# Altium schematic sheet LM_And_Busler_CAM.SchDoc
size A; SheetNumber: 5; SheetTotal: 6
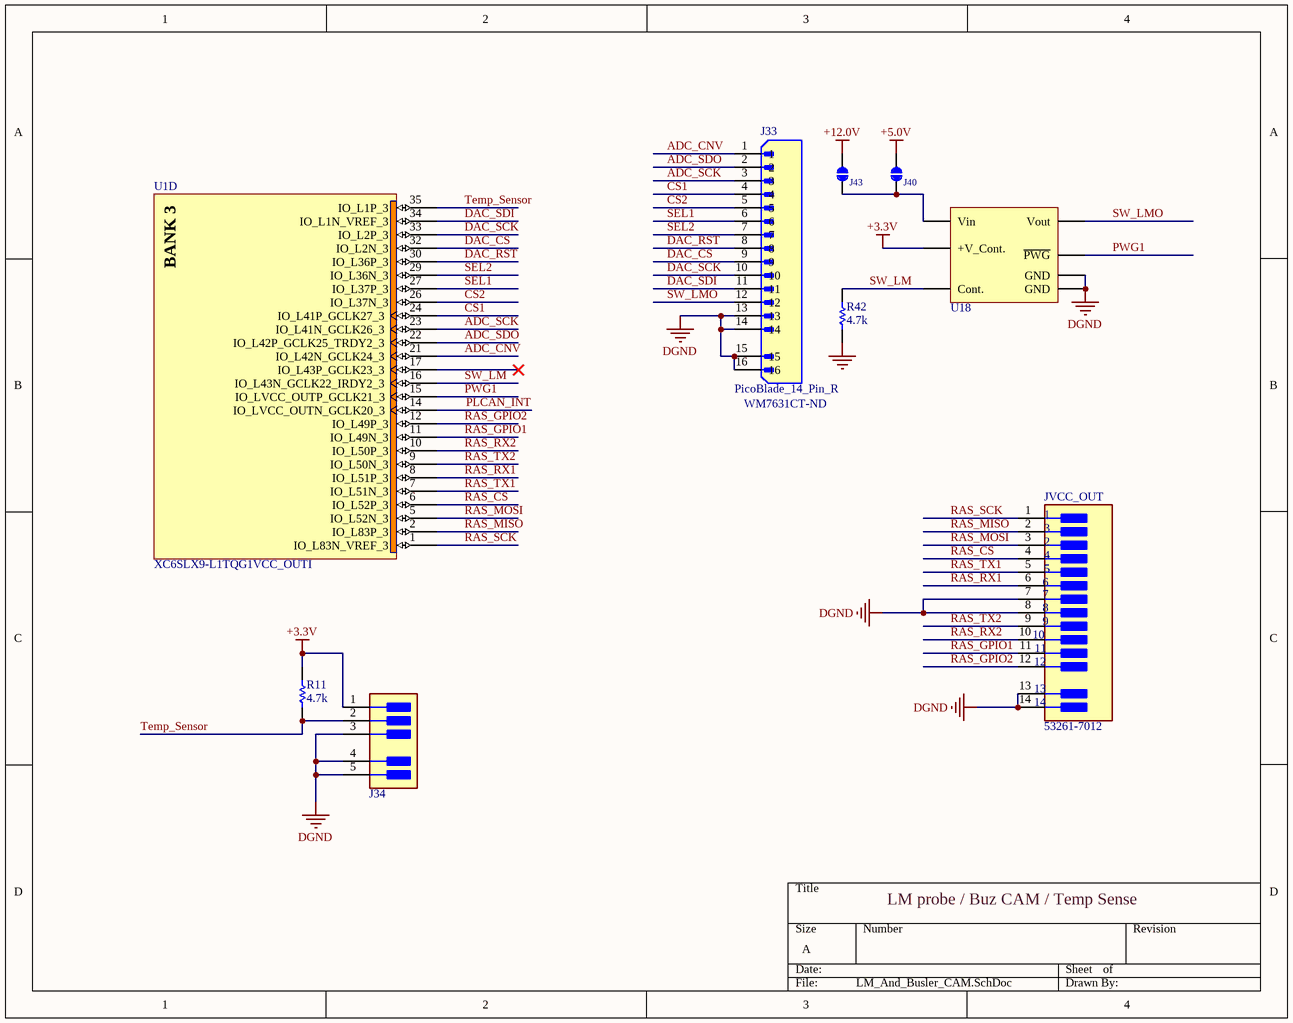
[diagram p0: LM_And_Busler_CAM.SchDoc]

## Parts
J33  PicoBlade_14_Pin_R  Supplier Part Number 1: WM7631CT-ND  [PicoBlade_14_pin_R]
J34  53261-0371  [FP-53261-0371-MFG]  (value not drawn)
J40  JUMPER  [SJMP]  (value not drawn)
J43  JUMPER  [SJMP]  (value not drawn)
JVCC_OUT  53261-7012  [MOLEX_12RA]
R11  Resistance (Ohms): 4.7k  [0603RES]  (hidden comment: RES_4.7K_0.1W_0603)
R42  Resistance (Ohms): 4.7k  [0603RES]  (hidden comment: RES_4.7K_0.1W_0603)
U1  XC6SLX9-L1TQG1VCC_OUTI  [TQG144_M]  (part D of 7)
U18  LTC3461 module  [OCPfootprint]  (value not drawn)

## Nets
+3.3V: J34.1 R11.2 U18.5(+V_Cont.)
+5.0V: J40.2
+12.0V: J43.2
DGND: J33.13 J33.14 J33.15 J33.16 J34.3 J34.4 J34.5 JVCC_OUT.7 JVCC_OUT.8 JVCC_OUT.13(MNT_1) JVCC_OUT.14(MNT_2) R42.2 U18.2(GND) U18.4(GND)
ADC_CNV: J33.1 U1.21(IO_L42N_GCLK24_3)
ADC_SCK: J33.3 U1.23(IO_L41N_GCLK26_3)
ADC_SDO: J33.2 U1.22(IO_L42P_GCLK25_TRDY2_3)
CS1: J33.4 U1.24(IO_L41P_GCLK27_3)
CS2: J33.5 U1.26(IO_L37N_3)
DAC_CS: J33.9 U1.32(IO_L2N_3)
DAC_RST: J33.8 U1.30(IO_L36P_3)
DAC_SCK: J33.10 U1.33(IO_L2P_3)
DAC_SDI: J33.11 U1.34(IO_L1N_VREF_3)
PLCAN_INT: U1.14(IO_LVCC_OUTN_GCLK20_3)
PWG1: U1.15(IO_LVCC_OUTP_GCLK21_3) U18.7(~{PWG})
RAS_CS: JVCC_OUT.4 U1.6(IO_L52P_3)
RAS_GPIO1: JVCC_OUT.11 U1.11(IO_L49N_3)
RAS_GPIO2: JVCC_OUT.12 U1.12(IO_L49P_3)
RAS_MISO: JVCC_OUT.2 U1.2(IO_L83P_3)
RAS_MOSI: JVCC_OUT.3 U1.5(IO_L52N_3)
RAS_RX1: JVCC_OUT.6 U1.8(IO_L51P_3)
RAS_RX2: JVCC_OUT.10 U1.10(IO_L50P_3)
RAS_SCK: JVCC_OUT.1 U1.1(IO_L83N_VREF_3)
RAS_TX1: JVCC_OUT.5 U1.7(IO_L51N_3)
RAS_TX2: JVCC_OUT.9 U1.9(IO_L50N_3)
SEL1: J33.6 U1.27(IO_L37P_3)
SEL2: J33.7 U1.29(IO_L36N_3)
SW_LM: R42.1 U1.16(IO_L43N_GCLK22_IRDY2_3) U18.6(Cont.)
SW_LMO: J33.12 U18.3(Vout)
Temp_Sensor: J34.2 R11.1 U1.35(IO_L1P_3)
NetJ40_1: J40.1 J43.1 U18.1(Vin)

Not connected (* = marked no-connect by the designer): U1 17(IO_L43P_GCLK23_3)*

## Notes on the sheet
- LM probe / Buz CAM / Temp Sense
- (in symbol XC6SLX9-L1TQG144I, part D) BANK 3

## Library data of the parts
J33 = PicoBlade_14_Pin_R: 1.25mm Pitch PicoBlade Header, Surface Mount, Right Angle, Lead-Free, 14 Circuits; Manufacturer: Molex; Manufacturer Part Number: 53261-1471; Supplier 1: Digi-Key; RoHS: Yes; Category: Headers and Wire Housings; ComponentLink1URL: https://datasheet.ciiva.com/5155/0532611471-pcb-headers-256969-5155455.pdf?src-supplier=Mouser; ComponentLink1Description: https://datasheet.ciiva.com/5155/0532611471-pcb-headers-256969-5155455.pdf?src-supplier=Mouser; ComponentLink2URL: https://datasheet.ciiva.com/30130/318250532611471-pcb-headers-30130464.pdf?src-supplier=Onlinecomponents.com; ComponentLink2Description: https://datasheet.ciiva.com/30130/318250532611471-pcb-headers-30130464.pdf?src-supplier=Onlinecomponents.com; ComponentLink3URL: https://datasheet.ciiva.com/11747/0900766b80d6dd0d-11747778.pdf?src-supplier=RSComponents; ComponentLink3Description: https://datasheet.ciiva.com/11747/0900766b80d6dd0d-11747778.pdf?src-supplier=RSComponents; ComponentLink4URL: https://datasheet.ciiva.com/7167/1626126-7167505.pdf?src-supplier=Newark; ComponentLink4Description: https://datasheet.ciiva.com/7167/1626126-7167505.pdf?src-supplier=Newark; ComponentLink5URL: https://datasheet.ciiva.com/14156/gh116861-116874-e-14156197.pdf?src-supplier=Distrelec; ComponentLink5Description: https://datasheet.ciiva.com/14156/gh116861-116874-e-14156197.pdf?src-supplier=Distrelec; ComponentLink6URL: https://datasheet.ciiva.com/7814/1767586-7814875.pdf?src-supplier=Element14; ComponentLink6Description: https://datasheet.ciiva.com/7814/1767586-7814875.pdf?src-supplier=Element14
J34 = 0532610371: Conn Shrouded Header HDR 3 POS 1.25mm Solder RA SMD PicoBlade™ Embossed T/R; Manufacturer: Molex; ComponentLink2Description: Datasheet; ComponentLink2URL: https://www.molex.com/webdocs/datasheets/pdf/en-us/0532610371_PCB_HEADERS.pdf; Supplier 1: Digi-Key; Manufacturer Part Number: 53261-0371; RoHS: Yes; Category: Headers and Wire Housings; Stock 1: 30734; Pricing 1: 1=0.72000, 10=0.61000, 100=0.47430 (USD); Supplier Part Number 1: WM7621CT-ND
J40 J43 = JUMPER: OPTION SELECTION PAD; Supplier 1: Digi-Key
JVCC_OUT = 53261-7012: 1.25mm Pitch, PicoBlade PCB Header, Single Row, Right-Angle, Surface Mount, Gold (Au) Plating, Friction Lock, 12...; Manufacturer: Molex; Supplier 1: Digi-Key; Manufacturer Part Number: 53261-7012; RoHS: No; Category: Headers and Wire Housings; Stock 1: 1355; Pricing 1: 1=2.68000, 10=2.28100, 100=1.88470 (USD); Supplier Part Number 1: 900-0532617012CT-ND
R11 R42 = RES_4.7K_0.1W_0603: Resistor; Manufacturer: Stackpole Electronics Inc.; Manufacturer Part Number: RMCF0603JT4K70; Tolerance: ±5%; Power (Watts): 0.1W, 1/10W; Temperature Coefficient: ±200ppm/°C; Supplier 1: Digi-Key; RoHS: RoHS Compliant; Category: Resistors; Stock 1: 86000; Pricing 1: 1=0.1, 10=0.012, 25=0.0088, 50=0.0066, 100=0.0049, 250=0.00372, 500=0.00298, 1000=0.0022 (USD); Packaging: Cut Tape (CT); Part Status: Active; Composition: Thick Film; Features: Automotive AEC-Q200; Operating Temperature: -55°C ~ 155°C; Package / Case: 0603 (1608 Metric); Supplier Device Package: 0603; Size / Dimension: 0.061" L x 0.031" W (1.55mm x 0.80mm); Height - Seated (Max): 0.022" (0.55mm); Number of Terminations: 2; Failure Rate: -; ComponentLink1URL: https://www.seielect.com/Catalog/SEI-RMCF_RMCP.pdf; ComponentLink1Description: https://www.seielect.com/Catalog/SEI-RMCF_RMCP.pdf; Supplier Part Number 1: RMCF0603JT4K70CT-ND
U1 = XC6SLX9-L1TQG144I: Spartan-6 LX 1.0V FPGA, 102 User I/Os, 144-Pin TQFP (0.5mm Pitch), Low Power Version, Industrial Grade, Pb-Free; Published: 17-Nov-2009; DatasheetVersion: ver1.6, Nov-2010; PackageVersion: ver1.2, Jun-2004; PackageReference: TQG144; Publisher: Altium Limited; PackageDescription: 144-Pin Thin Quad Flat Pack (TQG144) - Pb-Free; Code_JEDEC: MS-026-BFB; ComponentLink1Description: Manufacturer Link; ComponentLink1URL: http://www.xilinx.com; ComponentLink2Description: Spartan-6 Datasheet; ComponentLink2URL: http://www.xilinx.com/support/documentation/data_sheets/ds160.pdf; ComponentLink3Description: Spartan-6 Documents; ComponentLink3URL: http://www.xilinx.com/support/documentation/spartan-6.htm; ComponentLink4Description: Xilinx.com Home; ComponentLink4URL: http://www.xilinx.com; Supplier 1: Digi-Key; Supplier Part Number 1: 122-1779-ND
U18 = OCP_Module